# EAGLE schematic mainBoard (EAGLE 7.1.0)

## Sheet 1 of 8: PIC18F97J94
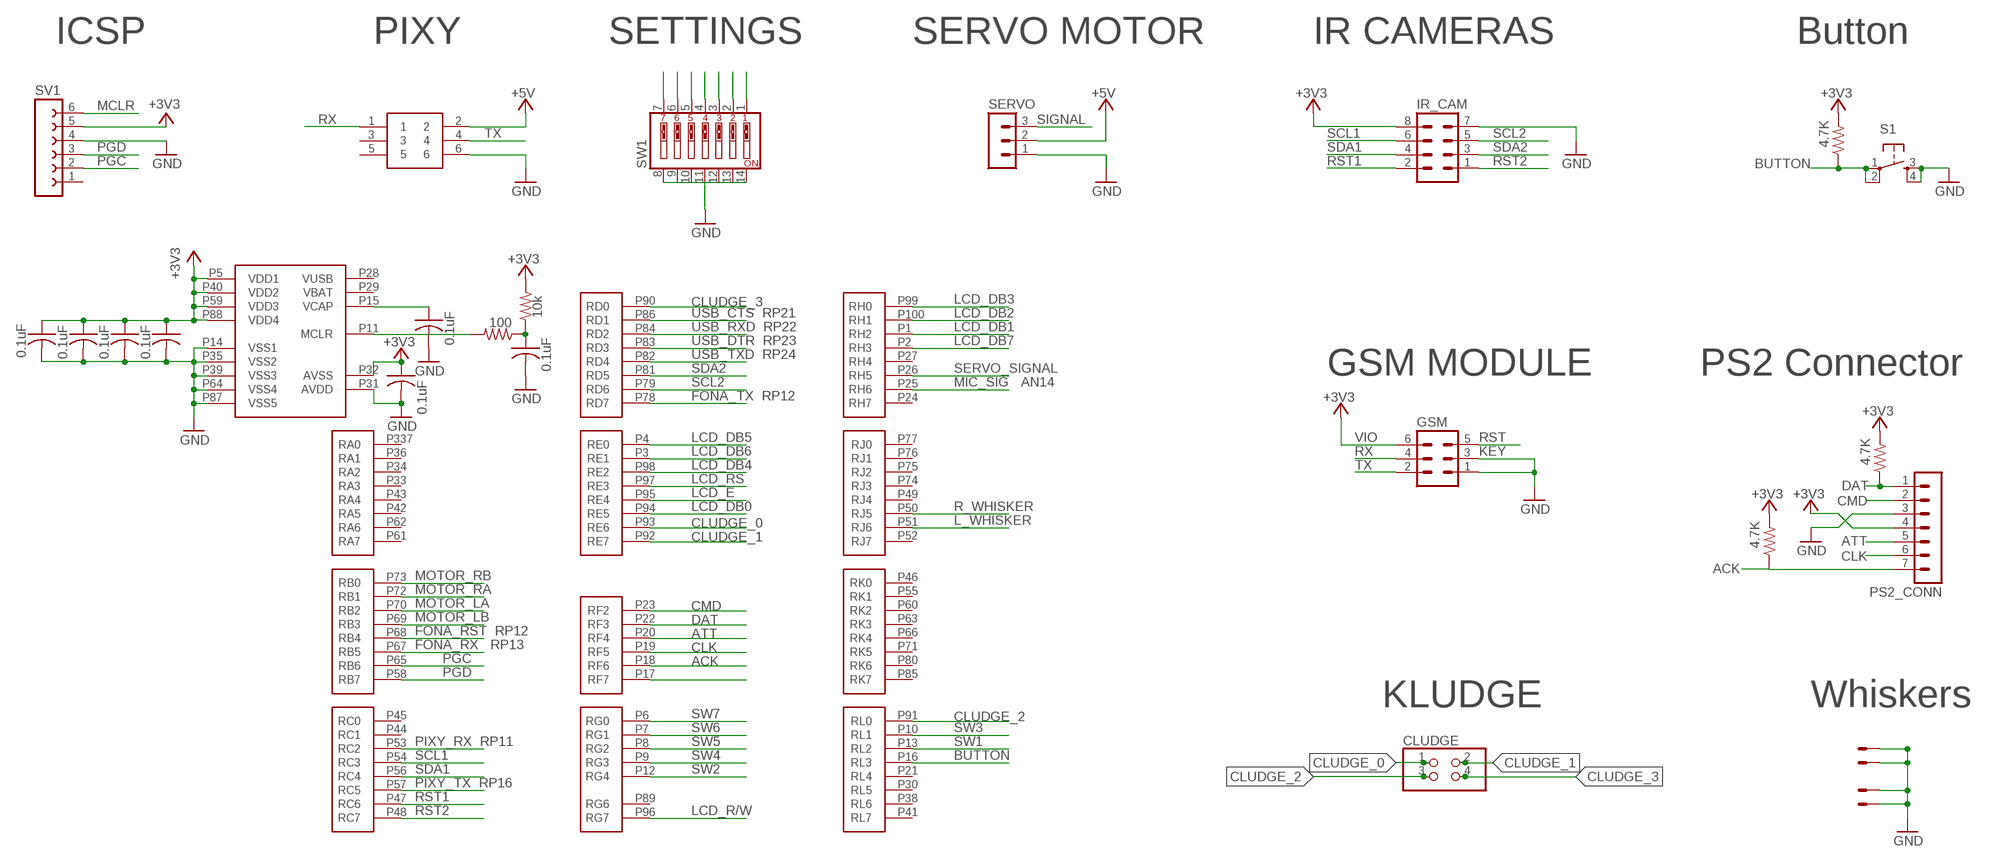
[diagram p0: schematic, sheet 1]

### Parts
C16  0.1uF  C-USC0805  [C0805]
C18  0.1uF  C-USC0805  [C0805]
C19  0.1uF  C-USC0805  [C0805]
C20  0.1uF  C-USC0805  [C0805]
C28  0.1uF  C-USC0805  [C0805]
C29  0.1uF  C-USC0805  [C0805]
C30  0.1uF  C-USC0805  [C0805]
CLUDGE  PINHD-2X2  [2X02]
GSM  MA03-2  [MA03-2]
IR_CAM  MA04-2  [MA04-2]
PS2_CONN  MA07-1  [MA07-1]
R16  100  R-US_R0805  [R0805]
R17  10k  R-US_R0805  [R0805]
R18  4.7K  R-US_M0805  [M0805]
R19  4.7K  R-US_M0805  [M0805]
R20  4.7K  R-US_M0805  [M0805]
S1  10-XX  [B3F-10XX]
SERVO  MA03-1  [MA03-1]
SV1  FE06-1  [FE06]
SW1  SW_DIP-7  [EDG-07]
U$1  PIC18F97J94  [QTFP-100]
U$15  PIXY  [PIXY_HEADER]
X1  22-23-2021  [22-23-2021]
X2  22-23-2021  [22-23-2021]

### Nets
+3V3: C16.1 C18.1 C19.1 C20.1 C28.1 GSM.6 IR_CAM.8 PS2_CONN.4 R17.2 R18.2 R19.2 R20.2 SV1.5 U$1.P5(VDD1) U$1.P32(AVSS) U$1.P40(VDD2) U$1.P59(VDD3) U$1.P88(VDD4) ; also sheet 2,3,4,6,7,8
+5V: SERVO.2 U$15.2 ; also sheet 4,8
ACK: PS2_CONN.7 R20.1 U$1.P18(RF6)
ATT: PS2_CONN.5 U$1.P20(RF4)
BUTTON: R18.1 S1.1(P) S1.2(P1) U$1.P16(RL3)
CLK: PS2_CONN.6 U$1.P19(RF5)
CLUDGE_0: CLUDGE.1 U$1.P93(RE6)
CLUDGE_1: CLUDGE.2 U$1.P92(RE7)
CLUDGE_2: CLUDGE.3 U$1.P91(RL0)
CLUDGE_3: CLUDGE.4 U$1.P90(RD0)
CMD: PS2_CONN.2 U$1.P23(RF2)
DAT: PS2_CONN.1 R19.1 U$1.P22(RF3)
GND: C16.2 C18.2 C19.2 C20.2 C28.2 C29.2 C30.2 GSM.1 GSM.3 IR_CAM.7 PS2_CONN.3 S1.3(S) S1.4(S1) SERVO.1 SV1.4 SW1.8 SW1.9 SW1.10 SW1.11 SW1.12 SW1.13 SW1.14 U$1.P14(VSS1) U$1.P31(AVDD) U$1.P35(VSS2) U$1.P39(VSS3) U$1.P64(VSS4) U$1.P87(VSS5) U$15.6 X1.1 X1.2 X2.1 X2.2 ; also sheet 2,3,4,5,6,7,8
GSM_RST: GSM.5 U$1.P68(RB4)
GSM_RX: GSM.4 U$1.P67(RB5)
GSM_TX: GSM.2 U$1.P78(RD7)
I2C_SCL: IR_CAM.6 U$1.P79(RD6) ; also sheet 3,6
I2C_SCL1: IR_CAM.5 U$1.P54(RC3)
I2C_SDA: IR_CAM.4 U$1.P81(RD5) ; also sheet 3,6
I2C_SDA1: IR_CAM.3 U$1.P56(RC4)
L_WHISKER: U$1.P51(RJ6)
LCD_DB0: U$1.P94(RE5) ; also sheet 8
LCD_DB1: U$1.P1(RH2) ; also sheet 8
LCD_DB2: U$1.P100(RH1) ; also sheet 8
LCD_DB3: U$1.P99(RH0) ; also sheet 8
LCD_DB4: U$1.P98(RE2) ; also sheet 8
LCD_DB5: U$1.P4(RE0) ; also sheet 8
LCD_DB6: U$1.P3(RE1) ; also sheet 8
LCD_DB7: U$1.P2(RH3) ; also sheet 8
LCD_E: U$1.P95(RE4) ; also sheet 8
LCD_R/W: U$1.P96(RG7) ; also sheet 8
LCD_RS: U$1.P97(RE3) ; also sheet 8
MCLR: R16.2 SV1.6 U$1.P11(MCLR)
MIC_SIG: U$1.P25(RH6) ; also sheet 2
MOTOR_LA: U$1.P70(RB2) ; also sheet 7
MOTOR_LB: U$1.P69(RB3) ; also sheet 7
MOTOR_RA: U$1.P72(RB1) ; also sheet 7
MOTOR_RB: U$1.P73(RB0) ; also sheet 7
N$33: U$1.P17(RF7)
N$48: C29.1 U$1.P15(VCAP)
N$49: C30.1 R16.1 R17.1
PGC: SV1.2 U$1.P65(RB6)
PGD: SV1.3 U$1.P58(RB7)
PIXY_RX: U$1.P53(RC2) U$15.1
PIXY_TX: U$1.P57(RC5) U$15.4
R_WHISKER: U$1.P50(RJ5)
RST1: IR_CAM.2 U$1.P47(RC6)
RST2: IR_CAM.1 U$1.P48(RC7)
SERVO_SIGNAL: SERVO.3 U$1.P26(RH5)
SW1: SW1.1 U$1.P13(RL2)
SW2: SW1.2 U$1.P12(RG4)
SW3: SW1.3 U$1.P10(RL1)
SW4: SW1.4 U$1.P9(RG3)
SW5: SW1.5 U$1.P8(RG2)
SW6: SW1.6 U$1.P7(RG1)
SW7: SW1.7 U$1.P6(RG0)
USB_CTS: U$1.P86(RD1) ; also sheet 5
USB_DTR: U$1.P83(RD3) ; also sheet 5
USB_RXD: U$1.P84(RD2) ; also sheet 5
USB_TXD: U$1.P82(RD4) ; also sheet 5
Unconnected: SV1.1 U$1.P21(RL4) U$1.P24(RH7) U$1.P27(RH4) U$1.P28(VUSB) U$1.P29(VBAT) U$1.P30(RL5) U$1.P33(RA3) U$1.P34(RA2) U$1.P36(RA1) U$1.P38(RL6) U$1.P41(RL7) U$1.P42(RA5) U$1.P43(RA4) U$1.P44(RC1) U$1.P45(RC0) U$1.P46(RK0) U$1.P49(RJ4) U$1.P52(RJ7) U$1.P55(RK1) U$1.P60(RK2) U$1.P61(RA7) U$1.P62(RA6) U$1.P63(RK3) U$1.P66(RK4) U$1.P71(RK5) U$1.P74(RJ3) U$1.P75(RJ2) U$1.P76(RJ1) U$1.P77(RJ0) U$1.P80(RK6) U$1.P85(RK7) U$1.P89(RG6) U$1.P337(RA0) U$15.3 U$15.5

### Notes on the sheet
- ICSP | PIXY | SETTINGS | SERVO MOTOR | IR CAMERAS | Button
- MCLR
- RX | SIGNAL
- TX | SCL1 | SCL2
- PGD | SDA1 | SDA2
- PGC | RST1 | RST2
- LCD_DB3
- USB_CTS  RP21 | LCD_DB2
- USB_RXD  RP22 | LCD_DB1
- USB_DTR  RP23 | LCD_DB7
- USB_TXD  RP24
- SDA2 | SERVO_SIGNAL | GSM MODULE | PS2 Connector
- SCL2 | MIC_SIG   AN14
- FONA_TX  RP12
- LCD_DB5 | VIO | RST
- LCD_DB6 | RX | KEY
- LCD_DB4 | TX
- LCD_RS
- LCD_E
- LCD_DB0 | R_WHISKER
- L_WHISKER
- MOTOR_RB
- MOTOR_RA
- MOTOR_LA
- MOTOR_LB
- FONA_RST  RP12
- FONA_RX   RP13
- PGC
- PGD
- KLUDGE | Whiskers
- SW7
- SW6 | SW3
- PIXY_RX  RP11 | SW5 | SW1
- SCL1 | SW4 | BUTTON
- SDA1 | SW2
- PIXY_TX  RP16
- RST1
- RST2 | LCD_R/W

## Sheet 2 of 8: Electret Mic Conditioning
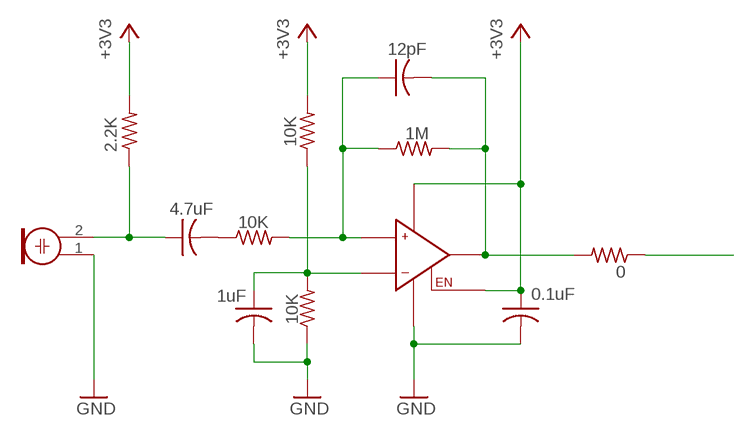
[diagram p1: schematic, sheet 2]

### Parts
C11  1uF  C-USC0805  [C0805]
C12  4.7uF  C-USC0805  [C0805]
C13  12pF  C-USC0805  [C0805]
C14  0.1uF  C-USC0805  [C0805]
M1  ELECTRET_MICROPHON-WM-63PR  [WM-63PR]
R1  10K  R-US_R0805  [R0805]
R2  1M  R-US_R0805  [R0805]
R4  2.2K  R-US_R0805  [R0805]
R5  10K  R-US_R0805  [R0805]
R6  10K  R-US_R0805  [R0805]
R7  0  R-US_R0805  [R0805]
U$4  OPA334  [OPA334]

### Nets
+3V3: C14.1 R4.2 R5.2 U$4.P$5(EN) U$4.P$6(V+) ; also sheet 1,3,4,6,7,8
GND: C11.2 C14.2 M1.1 R6.1 U$4.P$2(V-) ; also sheet 1,3,4,5,6,7,8
MIC_SIG: R7.1 ; also sheet 1
N$13: C12.2 R1.1
N$17: C12.1 M1.2 R4.1
N$21: C13.1 R1.2 R2.1 U$4.P$3(IN+)
N$22: C11.1 R5.1 R6.2 U$4.P$4(IN-)
N$24: C13.2 R2.2 R7.2 U$4.P$1(VOUT)

## Sheet 3 of 8: Compass Sensor
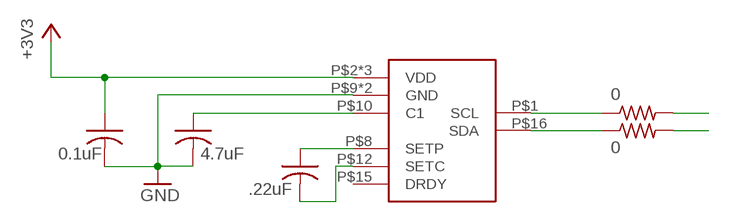
[diagram p2: schematic, sheet 3]

### Parts
C8  .22uF  C-USC0805  [C0805]
C9  4.7uF  C-USC0805  [C0805]
C10  0.1uF  C-USC0805  [C0805]
R8  0  R-US_R0805  [R0805]
R9  0  R-US_R0805  [R0805]
U$3  HMC5883L  [HMC5883L]

### Nets
+3V3: C10.1 U$3.P$2(VDD) U$3.P$4(VDD) U$3.P$13(VDD) ; also sheet 1,2,4,6,7,8
GND: C9.2 C10.2 U$3.P$9(GND) U$3.P$11(GND) ; also sheet 1,2,4,5,6,7,8
I2C_SCL: R8.2 ; also sheet 1,6
I2C_SDA: R9.2 ; also sheet 1,6
N$14: C8.1 U$3.P$8(SETP)
N$15: C8.2 U$3.P$12(SETC)
N$16: C9.1 U$3.P$10(C1)
N$19: R8.1 U$3.P$1(SCL)
N$20: R9.1 U$3.P$16(SDA)
Unconnected: U$3.P$15(DRDY)

## Sheet 4 of 8: Power circuity
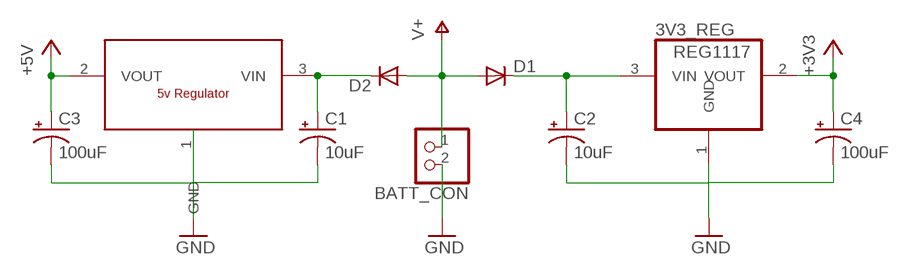
[diagram p3: schematic, sheet 4]

### Parts
3V3_REG  REG1117  [SOT223]
5V_REG  NCP1117-DPAK  [DPAK-2]
BATT_CON  JST_2PIN-THM  [JST-PH-2-THM]
C1  10uF  CPOL-USUD-4X5,8  [UD-4X5,8_NICHICON]
C2  10uF  CPOL-USUD-4X5,8  [UD-4X5,8_NICHICON]
C3  100uF  CPOL-USUD-6,3X5,8  [UD-6,3X5,8_NICHICON]
C4  100uF  CPOL-USUD-6,3X5,8  [UD-6,3X5,8_NICHICON]
D1  DIODE-SOD123  [SOD123]
D2  DIODE-SOD123  [SOD123]

### Nets
+3V3: 3V3_REG.2(VOUT) C4.+ ; also sheet 1,2,3,6,7,8
+5V: 5V_REG.2(VOUT) C3.+ ; also sheet 1,8
GND: 3V3_REG.1(GND) 5V_REG.1(GND) BATT_CON.2 C1.- C2.- C3.- C4.- ; also sheet 1,2,3,5,6,7,8
N$3: 5V_REG.3(VIN) C1.+ D2.C
N$4: 3V3_REG.3(VIN) C2.+ D1.C
V+: BATT_CON.1 D1.A D2.A ; also sheet 7

## Sheet 5 of 8: RS232 to USB
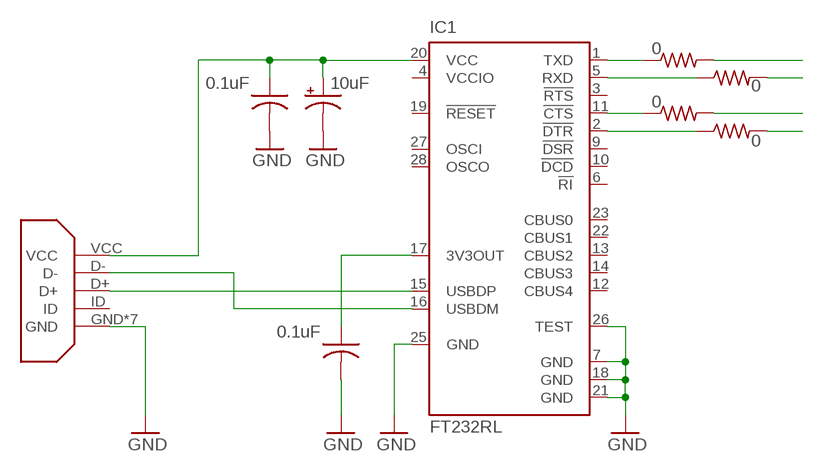
[diagram p4: schematic, sheet 5]

### Parts
C5  0.1uF  C-USC0805  [C0805]
C6  10uF  CPOL-USUD-4X5,8  [UD-4X5,8_NICHICON]
C7  0.1uF  C-USC0805  [C0805]
IC1  FT232RL  [SSOP28]
R10  0  R-US_R0805  [R0805]
R11  0  R-US_R0805  [R0805]
R12  0  R-US_R0805  [R0805]
R13  0  R-US_R0805  [R0805]
U$2  MICRO_USB  [MICRO_USB_FCI]

### Nets
GND: C5.2 C6.- C7.2 IC1.7(GND) IC1.18(GND) IC1.21(GND) IC1.25(GND) IC1.26(TEST) U$2.GND U$2.GND1(GND) U$2.GND2(GND) U$2.P$1(GND) U$2.P$2(GND) U$2.P$3(GND) U$2.P$4(GND) ; also sheet 1,2,3,4,6,7,8
N$1: IC1.1(TXD) R10.1
N$2: IC1.5(RXD) R11.1
N$5: IC1.11(!CTS) R12.1
N$6: IC1.2(!DTR) R13.1
N$7: IC1.16(USBDM) U$2.D-
N$8: IC1.15(USBDP) U$2.D+
N$9: C5.1 IC1.17(3V3OUT)
N$10: C6.+ C7.1 IC1.20(VCC) U$2.VCC
USB_CTS: R12.2 ; also sheet 1
USB_DTR: R13.2 ; also sheet 1
USB_RXD: R11.2 ; also sheet 1
USB_TXD: R10.2 ; also sheet 1
Unconnected: IC1.3(!RTS) IC1.6(!RI) IC1.9(!DSR) IC1.10(!DCD) IC1.12(CBUS4) IC1.13(CBUS2) IC1.14(CBUS3) IC1.19(!RESET) IC1.22(CBUS1) IC1.23(CBUS0) IC1.27(OSCI) IC1.28(OSCO) U$2.ID

## Sheet 6 of 8: Color Sensor
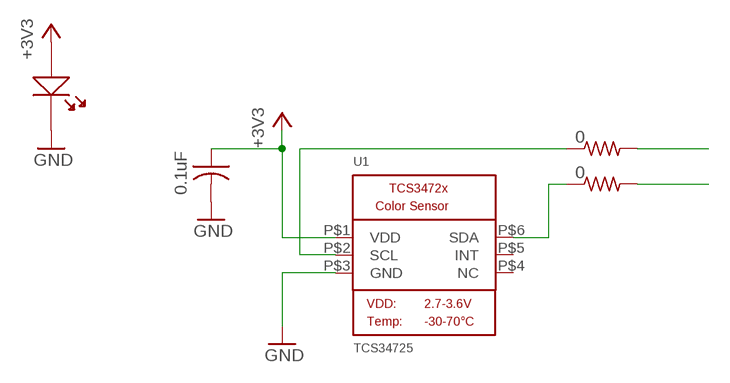
[diagram p5: schematic, sheet 6]

### Parts
C15  0.1uF  C-USC0805  [C0805]
R14  0  R-US_R0805  [R0805]
R15  0  R-US_R0805  [R0805]
U1  TCS34725  LIGHT_TCS3472  [TCS3472_FN6]
U$5  LED  [LED]

### Nets
+3V3: C15.1 U1.P$1(VDD) U$5.ANODE ; also sheet 1,2,3,4,7,8
GND: C15.2 U1.P$3(GND) U$5.CATHODE ; also sheet 1,2,3,4,5,7,8
I2C_SCL: R15.2 ; also sheet 1,3
I2C_SDA: R14.2 ; also sheet 1,3
N$26: R15.1 U1.P$2(SCL)
N$27: R14.1 U1.P$6(SDA)
Unconnected: U1.P$4(NC) U1.P$5(INT)

## Sheet 7 of 8: Motor Drive
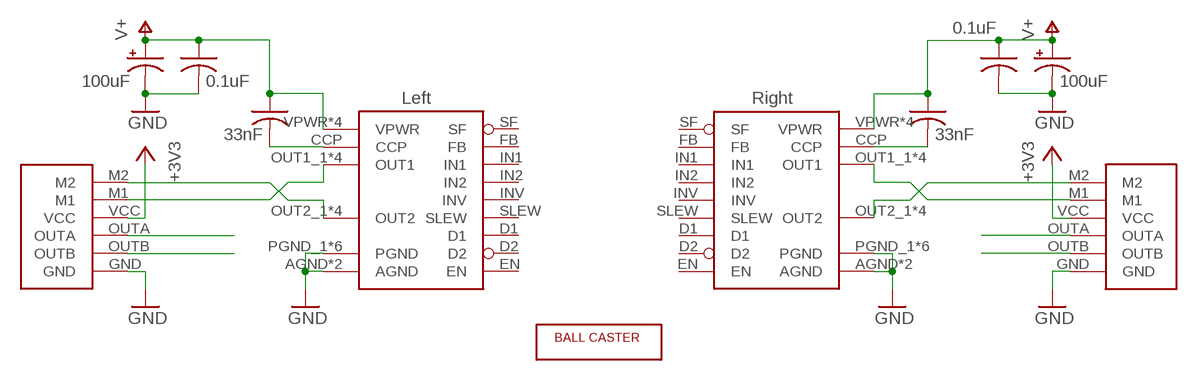
[diagram p6: schematic, sheet 7]

### Parts
C22  33nF  C-USC0805  [C0805]
C23  0.1uF  C-USC0805  [C0805]
C24  100uF  CPOL-USUD-4X5,8  [UD-4X5,8_NICHICON]
C25  33nF  C-USC0805  [C0805]
C26  0.1uF  C-USC0805  [C0805]
C27  100uF  CPOL-USUD-4X5,8  [UD-4X5,8_NICHICON]
U$7  POLOLU_BALLCASTER  [CASTER]
U$8  POLOLU_MOTORDRIVE  [MOTOR]
U$9  POLOLU_MOTORDRIVE  [MOTOR]
U$10  MOTORDRIVE  [PQFN]
U$11  MOTORDRIVE  [PQFN]

### Nets
+3V3: U$8.VCC U$9.VCC ; also sheet 1,2,3,4,6,8
GND: C23.2 C24.- C26.2 C27.- U$8.GND U$9.GND U$10.AGND U$10.AGND_L(AGND) U$10.PGND_1(PGND) U$10.PGND_2(PGND) U$10.PGND_3(PGND) U$10.PGND_4(PGND) U$10.PGND_5(PGND) U$10.PGND_6(PGND) U$11.AGND U$11.AGND_L(AGND) U$11.PGND_1(PGND) U$11.PGND_2(PGND) U$11.PGND_3(PGND) U$11.PGND_4(PGND) U$11.PGND_5(PGND) U$11.PGND_6(PGND) ; also sheet 1,2,3,4,5,6,8
MOTOR_LA: U$8.OUTA ; also sheet 1
MOTOR_LB: U$8.OUTB ; also sheet 1
MOTOR_RA: U$9.OUTA ; also sheet 1
MOTOR_RB: U$9.OUTB ; also sheet 1
N$11: C22.2 U$10.CCP
N$46: U$8.M1 U$10.OUT1_1(OUT1) U$10.OUT1_2(OUT1) U$10.OUT1_3(OUT1) U$10.OUT1_4(OUT1)
N$47: C25.2 U$11.CCP
N$70: U$8.M2 U$10.OUT2_1(OUT2) U$10.OUT2_2(OUT2) U$10.OUT2_3(OUT2) U$10.OUT2_4(OUT2)
N$71: U$9.M2 U$11.OUT2_1(OUT2) U$11.OUT2_2(OUT2) U$11.OUT2_3(OUT2) U$11.OUT2_4(OUT2)
N$72: U$9.M1 U$11.OUT1_1(OUT1) U$11.OUT1_2(OUT1) U$11.OUT1_3(OUT1) U$11.OUT1_4(OUT1)
V+: C22.1 C23.1 C24.+ C25.1 C26.1 C27.+ U$10.VPWR U$10.VPWR1(VPWR) U$10.VPWR2(VPWR) U$10.VPWR_2(VPWR) U$11.VPWR U$11.VPWR1(VPWR) U$11.VPWR2(VPWR) U$11.VPWR_2(VPWR) ; also sheet 4
Unconnected: U$10.D1 U$10.D2 U$10.EN U$10.FB U$10.IN1 U$10.IN2 U$10.INV U$10.SF U$10.SLEW U$11.D1 U$11.D2 U$11.EN U$11.FB U$11.IN1 U$11.IN2 U$11.INV U$11.SF U$11.SLEW

### Notes on the sheet
- Left | Right

## Sheet 8 of 8: LCD screen
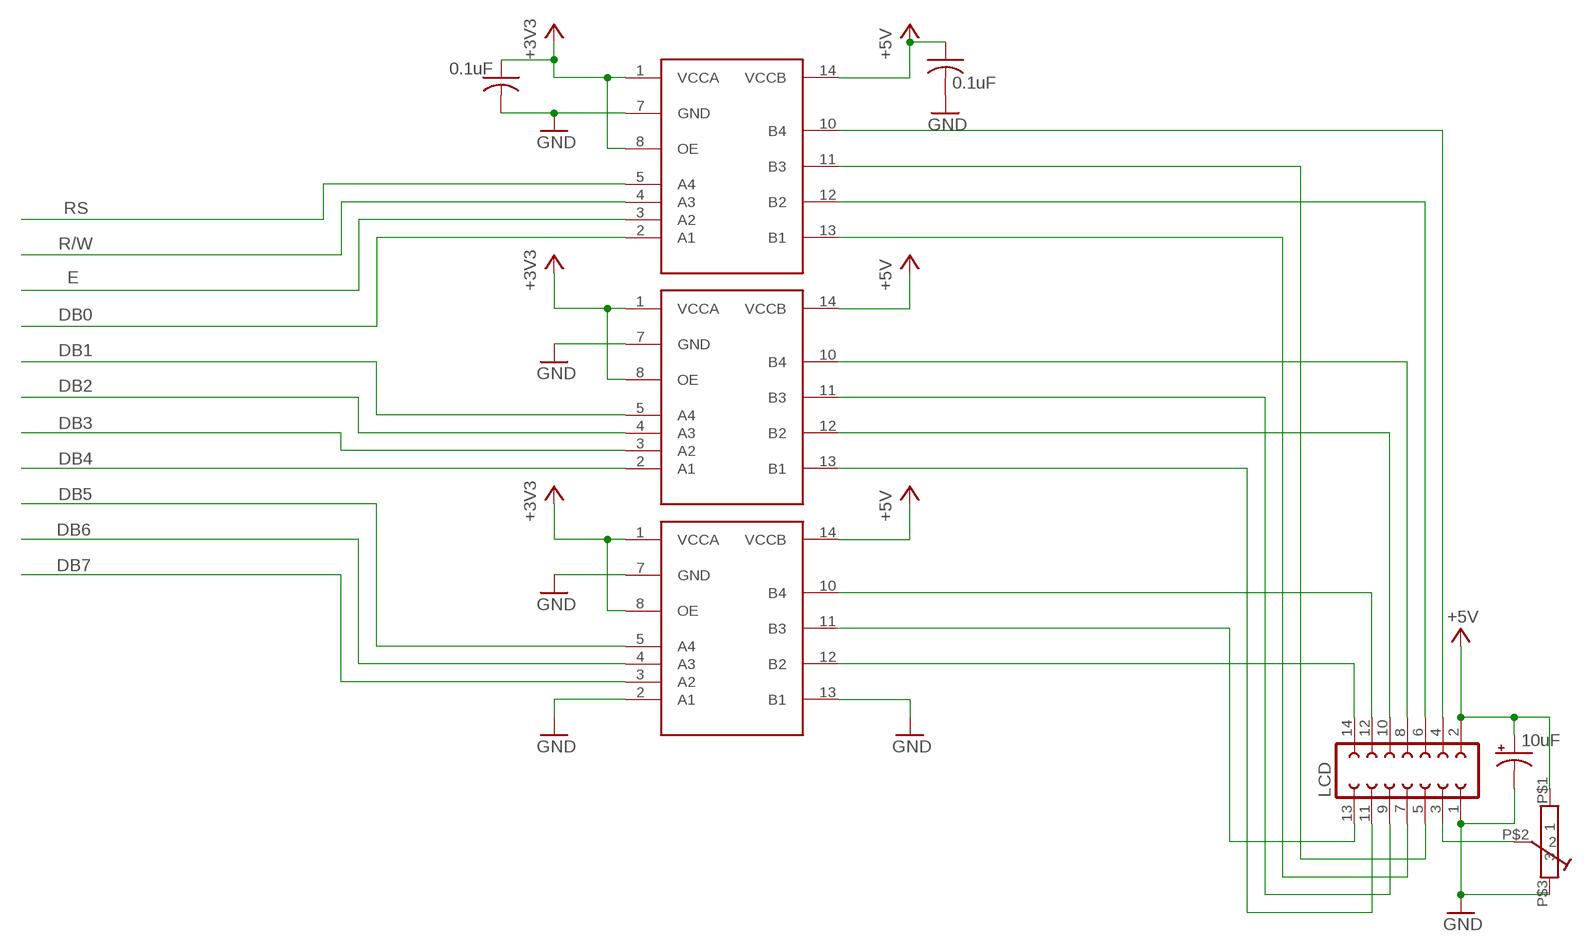
[diagram p7: schematic, sheet 8]

### Parts
10UF  10uF  CPOL-USUD-4X5,8  [UD-4X5,8_NICHICON]
C17  0.1uF  C-USC0805  [C0805]
C21  0.1uF  C-USC0805  [C0805]
LCD  FE07-2  [FE07-2]
U$6  PVG3G-SMD-TRIMMER  [PVG3G-SMT-TRIMMER]
U$12  TXB0104  [S-PVQFN-N14]
U$13  TXB0104  [S-PVQFN-N14]
U$14  TXB0104  [S-PVQFN-N14]

### Nets
+3V3: C17.1 U$12.1(VCCA) U$12.8(OE) U$13.1(VCCA) U$13.8(OE) U$14.1(VCCA) U$14.8(OE) ; also sheet 1,2,3,4,6,7
+5V: 10UF.+ C21.1 LCD.2 U$6.P$1 U$12.14(VCCB) U$13.14(VCCB) U$14.14(VCCB) ; also sheet 1,4
GND: 10UF.- C17.2 C21.2 LCD.1 U$6.P$3 U$12.7(GND) U$13.7(GND) U$14.2(A1) U$14.7(GND) U$14.13(B1) ; also sheet 1,2,3,4,5,6,7
LCD_DB0: U$12.2(A1) ; also sheet 1
LCD_DB1: U$13.5(A4) ; also sheet 1
LCD_DB2: U$13.4(A3) ; also sheet 1
LCD_DB3: U$13.3(A2) ; also sheet 1
LCD_DB4: U$13.2(A1) ; also sheet 1
LCD_DB5: U$14.5(A4) ; also sheet 1
LCD_DB6: U$14.4(A3) ; also sheet 1
LCD_DB7: U$14.3(A2) ; also sheet 1
LCD_E: U$12.3(A2) ; also sheet 1
LCD_R/W: U$12.4(A3) ; also sheet 1
LCD_RS: U$12.5(A4) ; also sheet 1
N$12: LCD.3 U$6.P$2
N$35: LCD.4 U$12.10(B4)
N$36: LCD.5 U$12.11(B3)
N$37: LCD.6 U$12.12(B2)
N$38: LCD.7 U$12.13(B1)
N$39: LCD.8 U$13.10(B4)
N$40: LCD.9 U$13.11(B3)
N$41: LCD.10 U$13.12(B2)
N$42: LCD.11 U$13.13(B1)
N$43: LCD.12 U$14.10(B4)
N$44: LCD.13 U$14.11(B3)
N$45: LCD.14 U$14.12(B2)

### Notes on the sheet
- RS
- R/W
- E
- DB0
- DB1
- DB2
- DB3
- DB4
- DB5
- DB6
- DB7

## Power pins joined to a net without a drawn wire
VCCIO: IC1.4(VCCIO)

## Library data of the parts
3V3_REG = burr-brown:REG1117: 800mA and 1A Low Dropout (LDO) Positive Regulator 1.8V, 2.5V, 2.85V, 3.3V, 5V, and Adj; MPN: REG1117; OC_FARNELL: 1097566; OC_NEWARK: 14P6981
5V_REG = NCP1117:NCP1117-DPAK
10UF C1-C4 C6 C24 C27 = rcl:CPOL-US: POLARIZED CAPACITOR, American symbol
BATT_CON = adafruit:JST_2PIN: JST 2-Pin Connectors of various flavors SMT-RA (S2B-PH-SM4) 4UConnector #17311 SMT (B2B-PH-SM4) THM-RA (S2B-PH) THM (B2B-PH)
C5 C7-C23 C25 C26 C28-C30 = rcl:C-US: CAPACITOR, American symbol
CLUDGE = HEADER-1X2-SMD:PINHD-2X2: PIN HEADER
D1 D2 = diode:DIODE-: DIODE
GSM = con-lstb:MA03-2: PIN HEADER; OC_FARNELL: unknown; OC_NEWARK: unknown
IC1 = ftdichip:FT232R: Source: http://www.ftdichip.com/Documents/DataSheets/DS_FT232R_v104.pdf; MPN: FT232RL; OC_FARNELL: 1146032; OC_NEWARK: 91K9918
IR_CAM = con-lstb:MA04-2: PIN HEADER; OC_FARNELL: unknown; OC_NEWARK: unknown
LCD = con-lsta:FE07-2: FEMALE HEADER; OC_FARNELL: unknown; OC_NEWARK: unknown
M1 = microphon:ELECTRET_MICROPHON-: Electret Condenser Microphone
PS2_CONN = con-lstb:MA07-1: PIN HEADER; OC_FARNELL: unknown; OC_NEWARK: unknown
R1 R2 R4-R17 = rcl:R-US_: RESISTOR, American symbol
R18-R20 = resistor:R-US_: RESISTOR, American symbol
S1 = switch-omron-SMD-VARIANT:10-XX: OMRON SWITCH; MPN: B3F-1000; OC_FARNELL: 176432; OC_NEWARK: 36M3542
SERVO = con-lstb:MA03-1: PIN HEADER; OC_FARNELL: unknown; OC_NEWARK: unknown
SV1 = con-lsta:FE06-1: FEMALE HEADER; OC_FARNELL: unknown; OC_NEWARK: unknown
SW1 = special:SW_DIP-7: DIP SWITCH
U1 = microbuilder:LIGHT_TCS3472: TCS3472 RGB + Clear Color Sensor VDD: 2.7-3.6V Temp: -30 - 70°C IR light blocking filter 3,800,000:1 Dynamic Range 2.5µA sleep state Part IDs TCS34725: I2C bus logic = VDD, I2C address: 0x29 TCS34727: I2C bus logic = 1.8V, I2C address: 0x29
U$1 = pic18f97j94:PIC18F97J94
U$2 = MicroUSB_FCI:MICRO_USB
U$3 = HMC5883L:HMC5883L
U$4 = OPA334:OPA334
U$5 = Wurth LED 158301240:LED
U$6 = MurataTrimmers:PVG3G-SMD-TRIMMER
U$7 = pololu_motordrive:POLOLU_BALLCASTER
U$8 U$9 = pololu_motordrive:POLOLU_MOTORDRIVE
U$10 U$11 = Freescale MotorDriver:MOTORDRIVE
U$12-U$14 = TXB0104:TXB0104
U$15 = pixyHeader:PIXY
X1 X2 = con-molex:22-23-2021: .100" (2.54mm) Center Header - 2 Pin; MF: MOLEX; MPN: 22-23-2021; OC_FARNELL: 1462926; OC_NEWARK: 25C3832